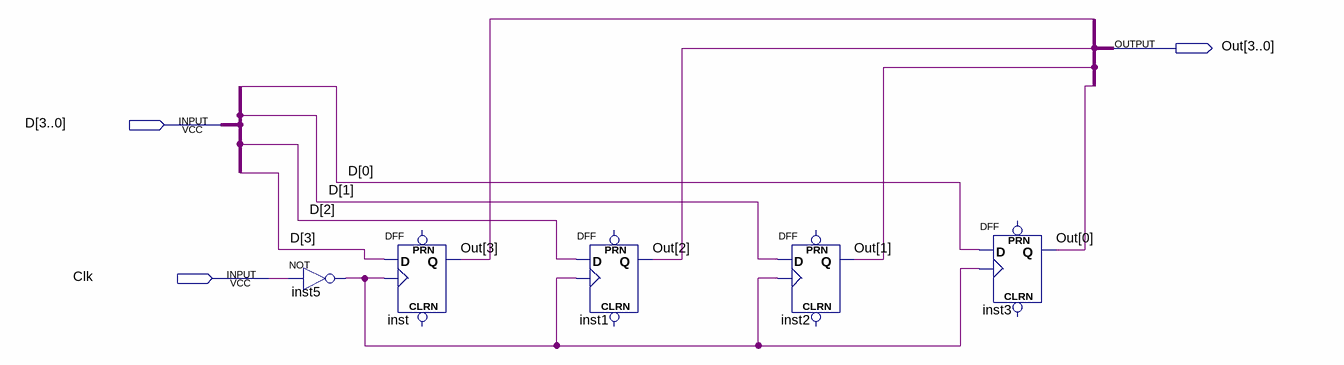
[diagram p0: schematic sheet]
// Quartus schematic Registru_Memorare.bdf as structural Verilog: 5 symbols, 3 pins
module Registru_Memorare (
  input  [3:0] D,
  input  Clk,
  output [3:0] Out
);

  wire inst5_out;

  not inst5 (inst5_out, Clk);
  DFF inst (.CLK(inst5_out), .D(D[3]), .Q(Out[3]));  // open: CLRN, PRN
  DFF inst1 (.CLK(inst5_out), .D(D[2]), .Q(Out[2]));  // open: CLRN, PRN
  DFF inst2 (.CLK(inst5_out), .D(D[1]), .Q(Out[1]));  // open: CLRN, PRN
  DFF inst3 (.CLK(inst5_out), .D(D[0]), .Q(Out[0]));  // open: CLRN, PRN
endmodule
